# Altium project relais_schaltung.PrjPcb
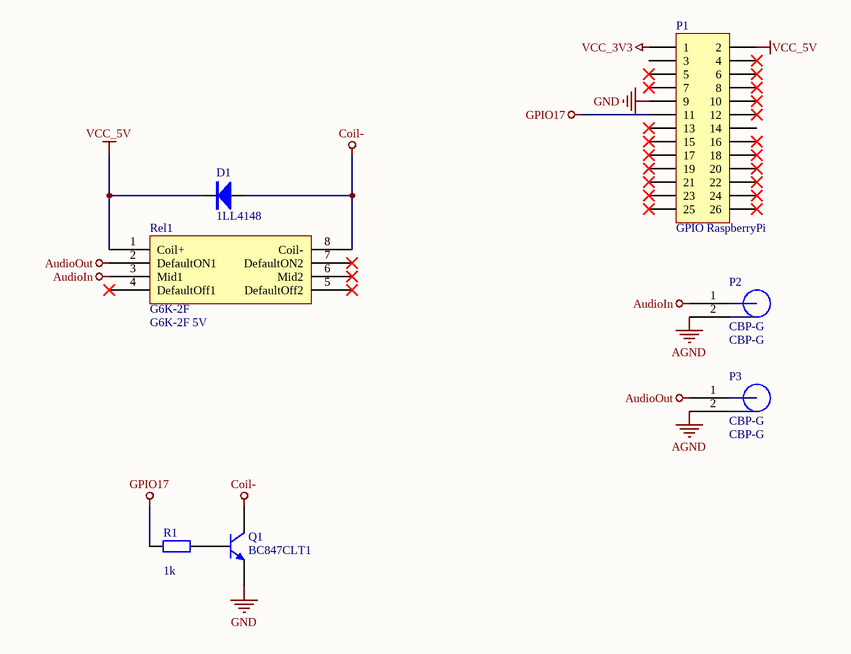
[diagram p0: relais_schaltung.SchDoc]
1 sheet, 7 parts. Net scope: global (net labels, ports and power ports of the same name join across sheets).
Board file: relais_schaltung.PcbDoc

## Sheet relais_schaltung.SchDoc
size A4

### Parts
D1  1LL4148  [1206]
P1  GPIO RaspberryPi  [HDR2X13]
P2  CBP-G  [Cinch]
P3  CBP-G  [Cinch]
Q1  BC847CLT1  [SOT-23]
R1  value 1k  [0805]
Rel1  G6K-2F  Reichelt: G6K-2F 5V  [G6K-2F]

### Nets
AGND: P2.2(GND) P3.2(GND)
AudioIn: P2.1(Sig) Rel1.3(Mid1)
AudioOut: P3.1(Sig) Rel1.2(DefaultON1)
Coil-: D1.1(A) Q1.3(C) Rel1.8(Coil-)
GND: P1.9 Q1.2(E)
GPIO17: P1.11 R1.1
VCC_3V3: P1.1
VCC_5V: D1.2(K) P1.2 Rel1.1(Coil+)
NetQ1_1: Q1.1(B) R1.2

Not connected (* = marked no-connect by the designer): P1 3 4* 5* 6* 7* 8* 10* 12* 13* 14 15* 16* 17* 18* 19* 20* 21* 22* 23* 24* 25* 26*; Rel1 4(DefaultOff1)* 5(DefaultOff2)* 6(Mid2)* 7(DefaultON2)*

### Library data of the parts
D1 = 1N4148: Diode
P1 = Header 13X2: Header, 13-Pin, Dual row; LatestRevisionDate: 17-Jul-2002; LatestRevisionNote: Re-released for DXP Platform.; Publisher: Altium Limited
P2 P3 = Cinch Print: Reichelt: CBP-G
Q1 = BC847CLT1: General Purpose Transistor NPN Silicon; PackageDocument: 1997; Published: 29-Sep-2000; LatestRevisionDate: 17-Jul-2002; LatestRevisionNote: Re-released for DXP Platform.; DatasheetDocument: 1997; PackageReference: 318-08; Publisher: Altium Limited; ComponentLink1Description: Manufacturer Link; ComponentLink1URL: http://www.onsemi.com/site/products/landing?taxonomyID=194; ComponentLink2Description: Datasheet; ComponentLink2URL: http://www.onsemi.com/pub/Collateral/BC846ALT1-D.PDF
R1 = Res2: Resistor; Published: 8-Jun-2000; LatestRevisionDate: 17-Jul-2002; LatestRevisionNote: Re-released for DXP Platform.; PackageReference: AXIAL-0.4; Publisher: Altium Limited